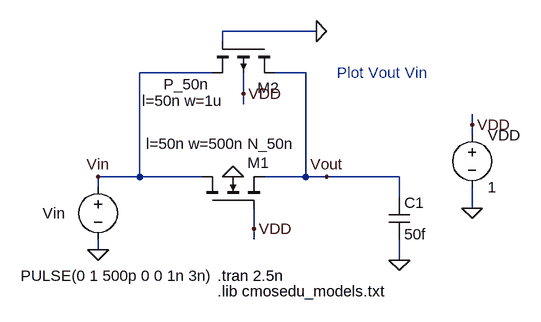
[diagram p0: schematic Fig10_20.asc]
Fig10_20.asc, the LTspice schematic file:
Version 4
SHEET 1 1136 680
WIRE 208 -96 208 -112
WIRE 208 0 208 -16
WIRE 272 -112 208 -112
WIRE 272 -112 272 -272
WIRE 368 -112 272 -112
WIRE 384 -272 272 -272
WIRE 400 -320 400 -336
WIRE 432 -240 432 -272
WIRE 432 -224 432 -240
WIRE 448 -32 448 -64
WIRE 448 -16 448 -32
WIRE 528 -272 480 -272
WIRE 528 -112 464 -112
WIRE 528 -112 528 -272
WIRE 544 -336 400 -336
WIRE 560 -112 528 -112
WIRE 672 -112 560 -112
WIRE 672 -80 672 -112
WIRE 672 16 672 -16
WIRE 784 -192 784 -208
WIRE 784 -176 784 -192
WIRE 784 -64 784 -96
FLAG 208 0 0
FLAG 672 16 0
FLAG 560 -112 Vout
FLAG 208 -112 Vin
FLAG 416 -112 0
FLAG 784 -64 0
FLAG 784 -192 VDD
FLAG 448 -32 VDD
FLAG 544 -336 0
FLAG 432 -240 VDD
SYMBOL nmos4 368 -64 R270
WINDOW 0 70 70 VRight 0
WINDOW 3 99 70 VRight 0
WINDOW 123 99 -86 VRight 0
SYMATTR InstName M1
SYMATTR Value N_50n
SYMATTR Value2 l=50n w=500n
SYMBOL voltage 208 -112 R0
WINDOW 0 -85 56 Left 0
WINDOW 3 -119 152 Left 0
WINDOW 123 0 0 Left 0
WINDOW 39 0 0 Left 0
SYMATTR InstName Vin
SYMATTR Value PULSE(0 1 500p 0 0 1n 3n)
SYMBOL cap 656 -80 R0
SYMATTR InstName C1
SYMATTR Value 50f
SYMBOL voltage 784 -192 R0
WINDOW 123 0 0 Left 0
WINDOW 39 0 0 Left 0
SYMATTR InstName VDD
SYMATTR Value 1
SYMBOL pmos4 480 -320 R90
WINDOW 0 71 -7 VRight 0
WINDOW 3 66 101 VRight 0
WINDOW 123 91 79 VRight 0
SYMATTR InstName M2
SYMATTR Value P_50n
SYMATTR Value2 l=50n w=1u
TEXT 392 40 Left 0 !.tran 2.5n
TEXT 392 64 Left 0 !.lib cmosedu_models.txt
TEXT 576 -272 Left 0 ;Plot Vout Vin

The netlist it stands for:
* Fig10_20.asc
M1 Vin VDD Vout 0 N_50n l=50n w=500n
Vin Vin 0 PULSE(0 1 500p 0 0 1n 3n)
C1 Vout 0 50f
VDD VDD 0 1
M2 Vout 0 Vin VDD P_50n l=50n w=1u
.model NMOS NMOS
.model PMOS PMOS
.lib standard.mos
.tran 2.5n
.lib cmosedu_models.txt
* Plot Vout Vin
.backanno
.end